# Altium project opo_v3.PrjPcb
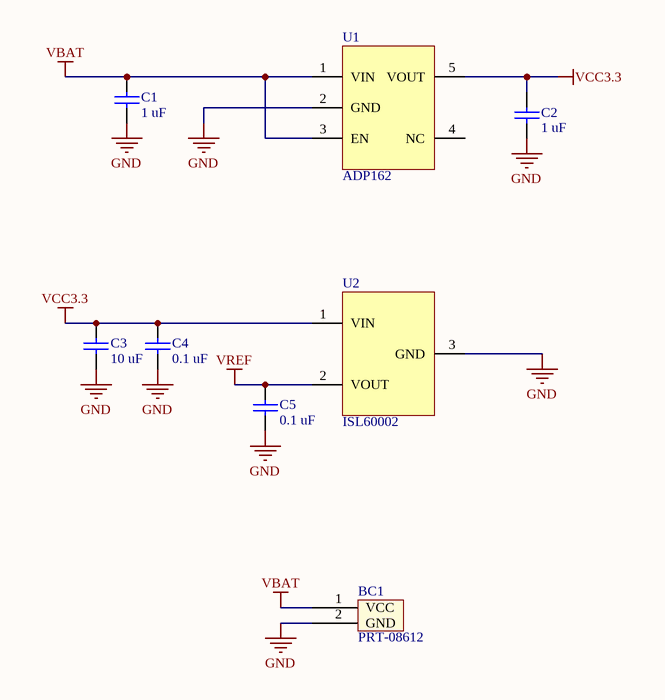
[diagram p0: power.SchDoc]
7 sheets, 103 parts. Net scope: flat (ports and power ports of the same name join across sheets).
Board file: opo_v3.0.PcbDoc
Sheets:
  power.SchDoc
  ultrasonic_rx.SchDoc
  ultrasonic_tx.SchDoc
  accero_humid_rtc.SchDoc
  mcu.SchDoc
  programming.SchDoc
  bluetooth.SchDoc

## Sheet power.SchDoc: Opo
size Letter; Author: William Huang; Engineer: William Huang; Revision: 3.0

### Parts
BC1  PRT-08612  [JST PH 2PIN]
C1  value 1 uF  [0402]  (hidden comment: Ceramic capacitor)
C2  value 1 uF  [0402]  (hidden comment: Ceramic capacitor)
C3  value 10 uF  [0402]  (hidden comment: Ceramic capacitor)
C4  value 0.1 uF  [0402]  (hidden comment: Ceramic capacitor)
C5  value 0.1 uF  [0402]  (hidden comment: Ceramic capacitor)
U1  ADP162  [TSOT23-5]
U2  ISL60002  [SOT23-3N]

### Nets
GND: BC1.2(GND) C1.2 C2.2 C3.2 C4.2 C5.2 U1.2(GND) U2.3(GND)
VBAT: BC1.1(VCC) C1.1 U1.1(VIN) U1.3(EN)
VCC3.3: C2.1 C3.1 C4.1 U1.5(VOUT) U2.1(VIN)
VREF: C5.1 U2.2(VOUT)

Not connected (* = marked no-connect by the designer): BC1 3 4; U1 4(NC)

### Notes on the sheet
- Title
- Date:
- Author:
- Revision:
- Sheet
- of
- University of Michigan
- File:

### Library data of the parts
BC1 = JST-PH-2mm-2Pin: 2-pin JST-PH 2mm Battery Connector; Supplier 1: Sparkfun; Supplier Part Number 1: PRT-08612
C1 C2 = C_1u_0402_ceramic: Ceramic capacitor, 1 uF, 0402 package; Manufacture: TDK; voltage rated: 6.3 V; tolerance: 10%; package: 0402; Supplier 1: Digi-Key; Supplier Part Number 1: 445-5000-1-ND
C3 = C_10u_0402_ceramic: Ceramic capacitor, 10 uF, 0402 package; Manufacture: TDK; voltage rated: 4V; tolerance: 20%; package: 0402; Supplier 1: Digi-Key; Supplier Part Number 1: 445-8919-1-ND
C4 C5 = C_0.1u_0402_ceramic: Ceramic capacitor, 0.1u, 0402 package; Manufacture: TDK; voltage rated: 10 V; tolerance: 10%; Supplier 1: Digi-Key; Supplier Part Number 1: 445-1265-1-ND; package: 0402
U1 = ADP162: IC REG LDO 3.3V 0.15A TSOT23-5; Supplier 1: Digi-Key; Supplier Part Number 1: ADP162AUJZ-3.3-R7CT-ND
U2 = ISL60002: IC VREF SERIES PREC SOT-23-3; Supplier 1: Digi-Key; Supplier Part Number 1: ISL60002DIH310Z-TKCT-ND

## Sheet ultrasonic_rx.SchDoc: Opo
size Letter; Author: William Huang; Engineer: William Huang; Revision: 3.0
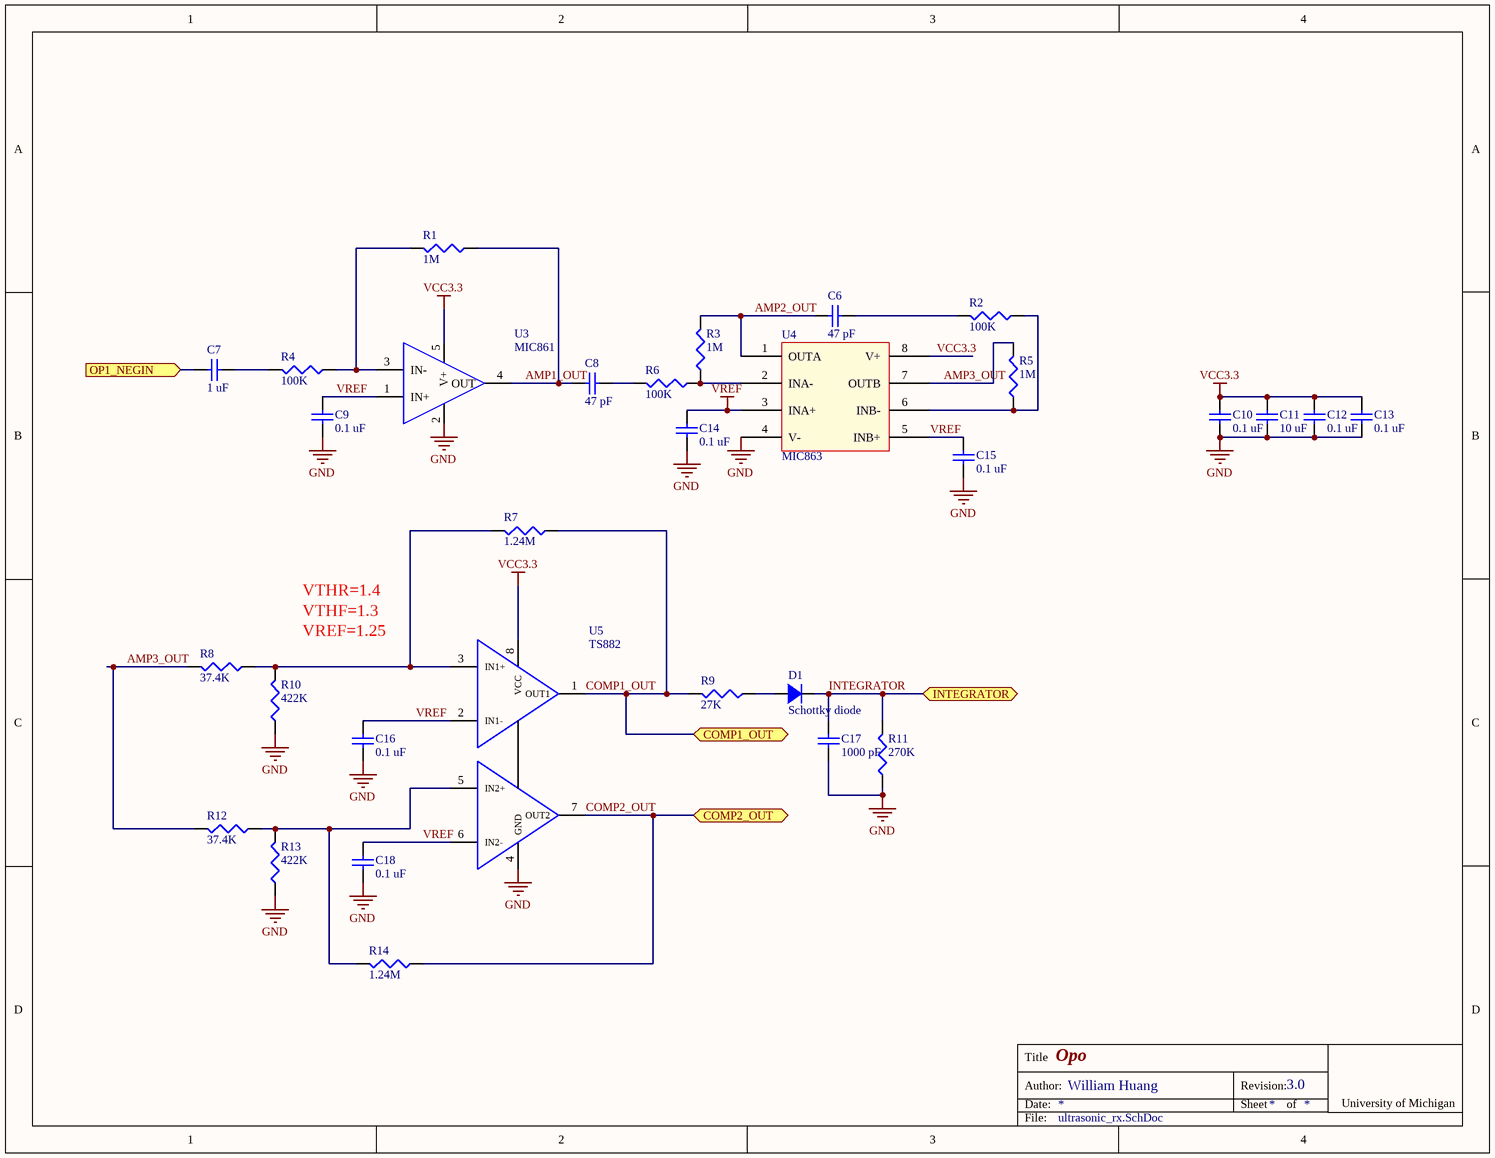
[diagram p1: ultrasonic_rx.SchDoc]

### Parts
C6  value 47 pF  [0402]  (hidden comment: Ceramic capacitor)
C7  value 1 uF  [0402]  (hidden comment: Ceramic capacitor)
C8  value 47 pF  [0402]  (hidden comment: Ceramic capacitor)
C9  value 0.1 uF  [0402]  (hidden comment: Ceramic capacitor)
C10  value 0.1 uF  [0402]  (hidden comment: Ceramic capacitor)
C11  value 10 uF  [0603]  (hidden comment: Ceramic capacitor)
C12  value 0.1 uF  [0402]  (hidden comment: Ceramic capacitor)
C13  value 0.1 uF  [0402]  (hidden comment: Ceramic capacitor)
C14  value 0.1 uF  [0402]  (hidden comment: Ceramic capacitor)
C15  value 0.1 uF  [0402]  (hidden comment: Ceramic capacitor)
C16  value 0.1 uF  [0402]  (hidden comment: Ceramic capacitor)
C17  value 1000 pF  [0402]  (hidden comment: Ceramic capacitor)
C18  value 0.1 uF  [0402]  (hidden comment: Ceramic capacitor)
D1  Schottky diode  [0603 - DIODE]
R1  value 1M  [0402]  (hidden comment: Chip resistor)
R2  value 100K  [0402]  (hidden comment: Chip resistor)
R3  value 1M  [0402]  (hidden comment: Chip resistor)
R4  value 100K  [0402]  (hidden comment: Chip resistor)
R5  value 1M  [0402]  (hidden comment: Chip resistor)
R6  value 100K  [0402]  (hidden comment: Chip resistor)
R7  value 1.24M  [0402]  (hidden comment: Chip resistor)
R8  value 37.4K  [0402]  (hidden comment: Chip resistor)
R9  value 27K  [0402]  (hidden comment: Chip resistor)
R10  value 422K  [0402]  (hidden comment: Chip resistor)
R11  value 270K  [0402]  (hidden comment: Chip resistor)
R12  value 37.4K  [0402]  (hidden comment: Chip resistor)
R13  value 422K  [0402]  (hidden comment: Chip resistor)
R14  value 1.24M  [0402]  (hidden comment: Chip resistor)
U3  MIC861  [SC70-5]
U4  MIC863  [TSOP65P280X145-8N]
U5  TS882  [SO8]

### Ports
COMP1_OUT, COMP2_OUT, INTEGRATOR, OP1_NEGIN (in)

### Nets
GND: C9.2 C10.2 C11.2 C12.2 C13.2 C14.2 C15.2 C16.2 C17.2 C18.2 R10.2 R11.2 R13.2 U3.2(V-) U4.4(V-) U5.4(GND)
VCC3.3: C10.1 C11.1 C12.1 C13.1 U3.5(V+) U4.8(V+) U5.8(VCC)
VREF: C9.1 C14.1 C15.1 C16.1 C18.1 U3.1(IN+) U4.3(INA+) U4.5(INB+) U5.2(IN1-) U5.6(IN2-)
AMP1_OUT: C8.1 R1.2 U3.4(OUT)
AMP2_OUT: C6.1 R3.1 U4.1(OUTA)
AMP3_OUT: R5.1 R8.1 R12.1 U4.7(OUTB)
COMP1_OUT: R7.2 R9.1 U5.1(OUT1) ; port COMP1_OUT
COMP2_OUT: R14.2 U5.7(OUT2) ; port COMP2_OUT
INTEGRATOR: C17.1 D1.2 R11.1 ; port INTEGRATOR
NetC6_2: C6.2 R2.1
NetC7_1: C7.1 ; port OP1_NEGIN
NetC7_2: C7.2 R4.1
NetC8_2: C8.2 R6.1
NetD1_1: D1.1 R9.2
NetR1_1: R1.1 R4.2 U3.3(IN-)
NetR2_2: R2.2 R5.2 U4.6(INB-)
NetR3_2: R3.2 R6.2 U4.2(INA-)
NetR7_1: R7.1 R8.2 R10.1 U5.3(IN1+)
NetR12_2: R12.2 R13.1 R14.1 U5.5(IN2+)

### Notes on the sheet
- VTHR=1.4
- VTHF=1.3
- VREF=1.25
- Title
- Date:
- Author:
- Revision:
- Sheet
- of
- University of Michigan
- File:

### Library data of the parts
C6 C8 = C_47p_0402_ceramic: Ceramic capacitor, 47 pF, 0402 package; Manufacture: Johanson; voltage rated: 50 V; tolerance: 5%; package: 0402; Supplier 1: Digi-Key; Supplier Part Number 1: 709-1121-1-ND
C7 = C_1u_0402_ceramic: as C1 on sheet power; package: 0402; Supplier 1: Digi-Key; Supplier Part Number 1: 445-5000-1-ND
C9 C10 C12-C16 C18 = C_0.1u_0402_ceramic: as C4 on sheet power; Supplier 1: Digi-Key; Supplier Part Number 1: 445-1265-1-ND; package: 0402
C11 = C_10u_0603_ceramic: Ceramic capacitor, 10 uF, 0603 package; Manufacture: TDK; voltage rated: 6.3V; tolerance: 20%; package: 0603; Supplier 1: Digi-Key; Supplier Part Number 1: 445-4112-1-ND
C17 = C_1000p_0402_ceramic: Ceramic capacitor, 1000 pF, 0402 package; Manufacture: TDK; voltage rated: 50 V; tolerance: 10%; package: 0402; Supplier 1: Digi-Key; Supplier Part Number 1: 445-6846-1-ND
D1 = D_SCHOTTKY_30V_0.1A_0603: Schottky diode 30 V 0.1 A 0603; package: 0603; Supplier 1: Digi-Key; Supplier Part Number 1: 641-1282-1-ND
R1 R3 R5 = R_1M_0402: Chip resistor, 1M, 0402 package; tolerance: 1%; power: 1/16 W; Supplier 1: Digi-Key; package: 0402; Supplier Part Number 1: 541-1.00MLCT-ND
R2 R4 R6 = R_100K_0402: Chip resistor, 100K, 0402 package; tolerance: 1%; power: 1/16 W; Supplier 1: Digi-Key; Supplier Part Number 1: 541-100KLCT-ND; package: 0402
R7 R14 = R_1.24M_0402: Chip resistor, 1.24M, 0402 package; tolerance: 1%; power: 1/16 W; package: 0402; Supplier 1: Digi-Key; Supplier Part Number 1: 541-1.24MLCT-ND
R8 R12 = R_37.4K_0402: Chip resistor, 37.4K, 0402 package; tolerance: 1%; power: 1/16 W; package: 0402; Supplier 1: Digi-Key; Supplier Part Number 1: 541-37.4KLCT-ND
R9 = R_27K_0402: Chip resistor, 27K, 0402 package; tolerance: 1%; power: 1/16 W; package: 0402; Supplier 1: Digi-Key; Supplier Part Number 1: 541-27.0KLCT-ND
R10 R13 = R_422K_0402: Chip resistor, 422K, 0402 package; tolerance: 1%; power: 1/16 W; package: 0402; Supplier 1: Digi-Key; Supplier Part Number 1: 541-422KLCT-ND
R11 = R_270K_0402: Chip resistor, 270K, 0402 package; tolerance: 1%; power: 1/16 W; package: 0402; Supplier 1: Digi-Key; Supplier Part Number 1: 541-270KLCT-ND
U3 = MIC861: IC OPAMP 400KHZ 2.7V ULT LP SC70; Supplier 1: Digi-Key; Supplier Part Number 1: 576-2932-1-ND
U4 = MIC863: Dual Ultra Low Power Op Amp in SOT23-8; Supplier 1: Digi-Key; Supplier Part Number 1: 576-2934-1-ND
U5 = TS882: Ultra Low Power Dual Comparator; Supplier 1: Digikey; Supplier 2: Digikey; Supplier 2 Part Number: 497-13800-1-ND; Supplier Part Number 1: 497-14073-1-ND

## Sheet ultrasonic_tx.SchDoc: Opo
size Letter; Author: William Huang; Engineer: William Huang; Revision: 3.0
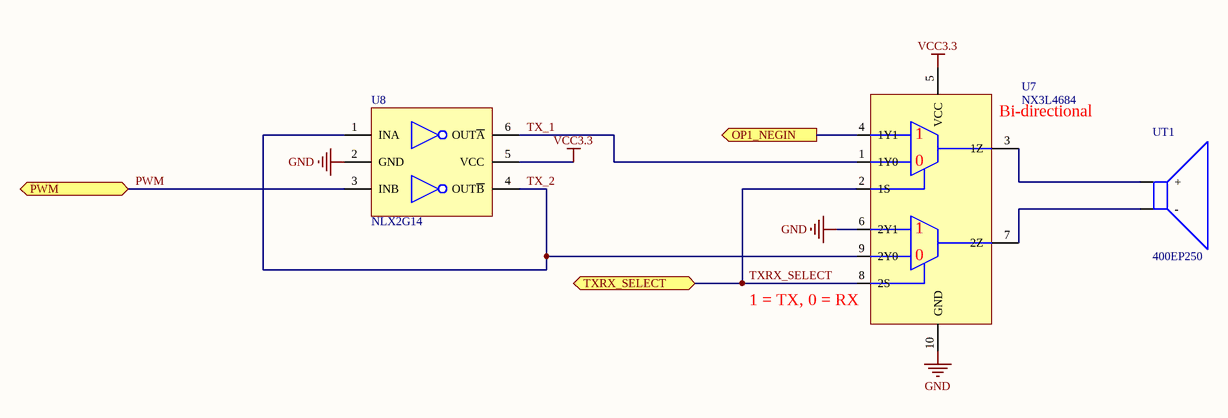
[diagram p2: ultrasonic_tx.SchDoc]

### Parts
U7  NX3L4684  [QFN50P155X200X13-10N]
U8  NLX2G14  [ULLGA6]
UT1  400EP250  [Transducer recepticle]

### Ports
OP1_NEGIN (out), PWM, TXRX_SELECT

### Nets
GND: U7.6(2Y1) U7.10(GND) U8.2(GND)
VCC3.3: U7.5(VCC) U8.5(VCC)
PWM: U8.3(INB) ; port PWM
TX_1: U7.1(1Y0) U8.6(OUT~{A})
TX_2: U7.9(2Y0) U8.1(INA) U8.4(OUT~{B})
TXRX_SELECT: U7.2(1S) U7.8(2S) ; port TXRX_SELECT
NetC7_1: U7.4(1Y1) ; port OP1_NEGIN
NetU7_3: U7.3(1Z) UT1.2(+)
NetU7_7: U7.7(2Z) UT1.1(-)

### Notes on the sheet
- (near U7) Bi-directional
- (near U7) 1 = TX, 0 = RX
- Title
- Date:
- Author:
- Revision:
- Sheet
- of
- University of Michigan
- File:
- (in symbol NX3L4684) 0

### Library data of the parts
U7 = NX3L4684: IC ANALOG SWITCH SPDT 10XQFN; Supplier 1: Digi-Key; Supplier Part Number 1: 568-5564-1-ND
U8 = NLX2G14: IC INVERTER DUAL SCHMTRIG ULLGA6; Supplier 1: Digi-Key; Supplier Part Number 1: NLX2G14AMX1TCGOSCT-ND
UT1 = Tranducer: Air Ultrasounic Ceramic Transducers; Supplier 1: Digi-Key; Supplier Part Number 1: ED90088-ND

## Sheet accero_humid_rtc.SchDoc: Opo
size Letter; Author: William Huang; Engineer: William Huang; Revision: 3.0
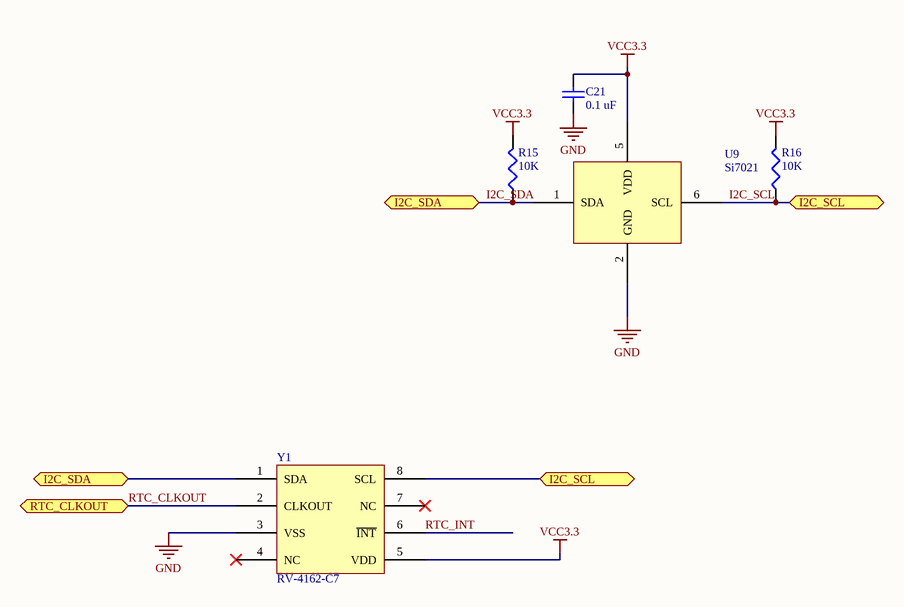
[diagram p3: accero_humid_rtc.SchDoc]

### Parts
C21  value 0.1 uF  [0402]  (hidden comment: Ceramic capacitor)
R15  value 10K  [0402]  (hidden comment: Chip resistor)
R16  value 10K  [0402]  (hidden comment: Chip resistor)
U9  Si7021  [DFN6-Si7021]
Y1  RV-4162-C7  [RV4162]

### Ports
I2C_SCL, I2C_SDA, RTC_CLKOUT

### Nets
GND: C21.2 U9.2(GND) Y1.3(VSS)
VCC3.3: C21.1 R15.1 R16.1 U9.5(VDD) Y1.5(VDD)
I2C_SCL: R16.2 U9.6(SCL) Y1.8(SCL) ; port I2C_SCL
I2C_SDA: R15.2 U9.1(SDA) Y1.1(SDA) ; port I2C_SDA
RTC_CLKOUT: Y1.2(CLKOUT) ; port RTC_CLKOUT
RTC_INT: Y1.6(~{INT})

Not connected (* = marked no-connect by the designer): U9 3(DNC) 4(DNC) 7(DNC); Y1 4(NC)* 7(NC)*

### Notes on the sheet
- Title
- Date:
- Author:
- Revision:
- Sheet
- of
- University of Michigan
- File:

### Library data of the parts
C21 = C_0.1u_0402_ceramic: as C4 on sheet power; Supplier 1: Digi-Key; Supplier Part Number 1: 445-1265-1-ND; package: 0402
R15 R16 = R_10K_0402: Chip resistor, 10K, 0402 package; tolerance: 1%; power: 1/16 W; Supplier 1: Digi-Key; Supplier Part Number 1: 541-10.0KLDKR-ND; package: 0402
U9 = Si7021: Temperature and Humidity Sensor; Supplier 1: Digikey; Supplier Part Number 1: 336-2542-1-ND
Y1 = RV-4162-C7: Real Time Clock Module with I2C Bus; Supplier 1: Newark; Supplier Part Number 1: 09X0517

## Sheet mcu.SchDoc: Opo
size Letter; Author: William Huang; Engineer: William Huang; Organization: Altium Limited; Address1: L3, 12a Rodborough Rd; Address2: Frenchs Forest; Address3: NSW; Address4: Australia 2086; Revision: 3.0; PageSetup: Record=PageOptions|CenterHorizontal=True|CenterVertical=True|PrintScale=0.94|XCorrection=1.00|YCorrection=1.00|PrintKind=0|BorderSize=5000000|LeftOffset=0|BottomOffset=0|Orientation=2|PaperLength=1000|PaperWidth=1000|Scale=100|PaperSource=7|PrintQuality=-4|MediaType=1|DitherType=10|PaperKind=Letter|PrintScaleMode=1
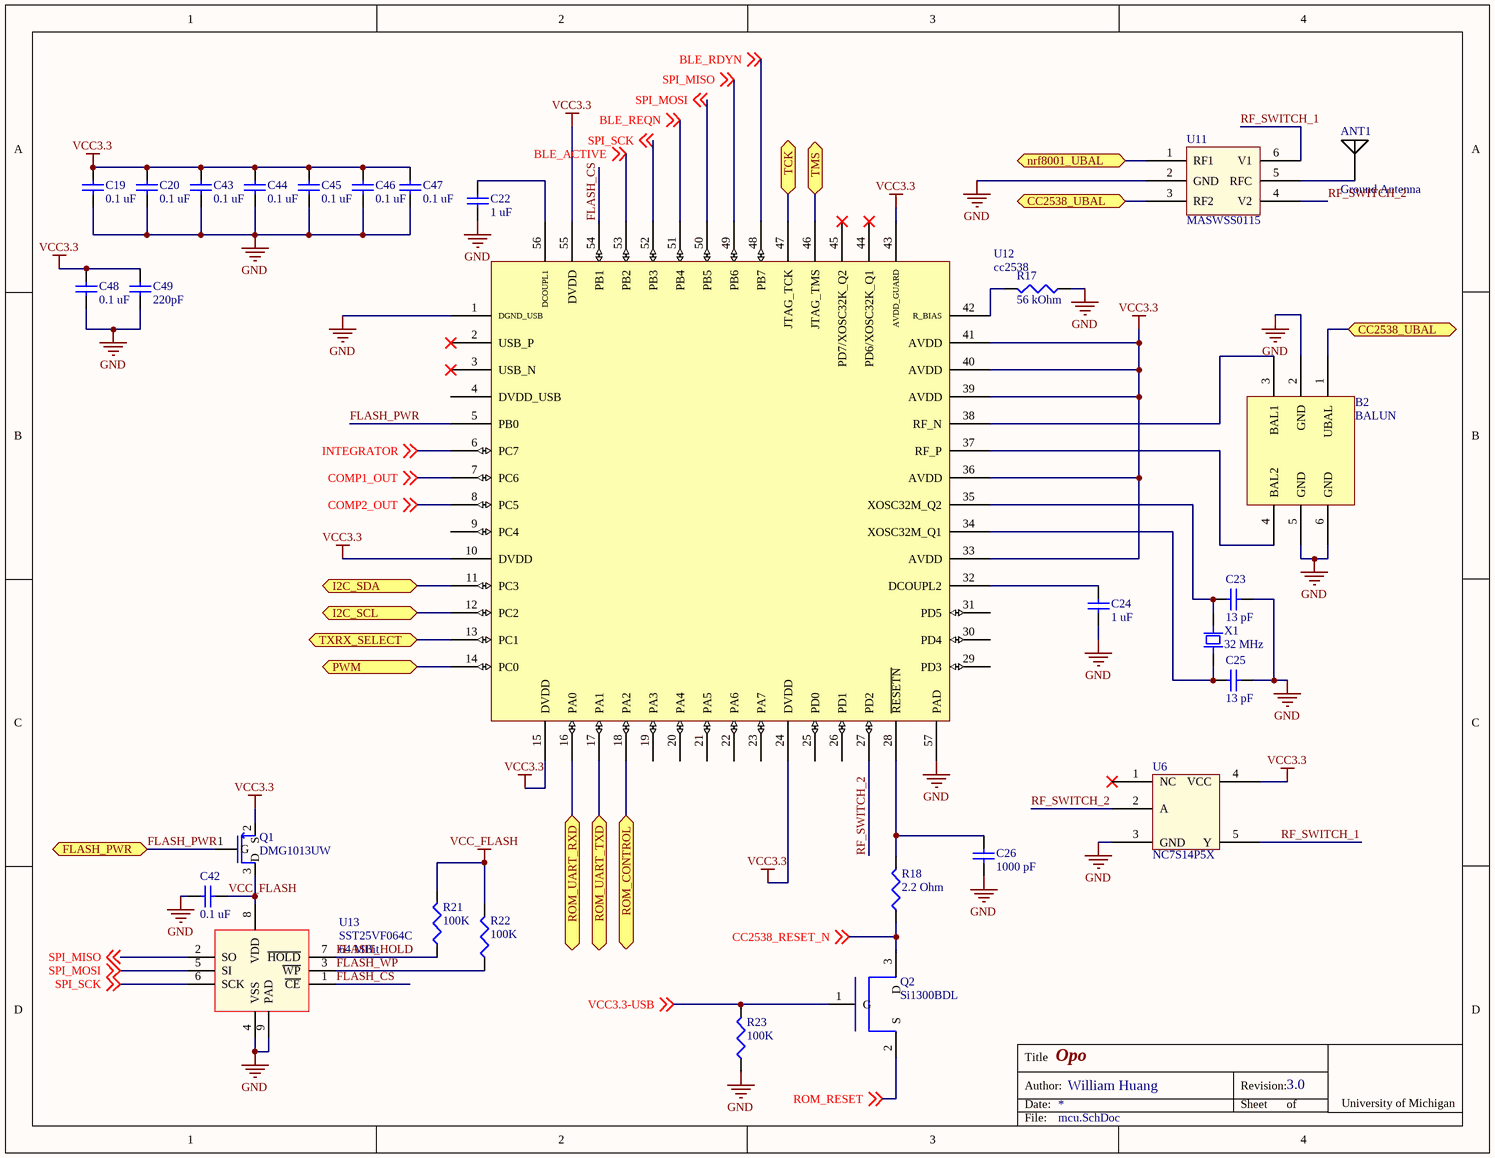
[diagram p4: mcu.SchDoc]

### Parts
ANT1  Ground Antenna  [Chip Antenna]
B2  BALUN  [Chip Balun]
C19  value 0.1 uF  [0402]  (hidden comment: Ceramic capacitor)
C20  value 0.1 uF  [0402]  (hidden comment: Ceramic capacitor)
C22  value 1 uF  [0402]  (hidden comment: Ceramic capacitor)
C23  value 13 pF  [0402]  (hidden comment: 13pf 0402 Cap)
C24  value 1 uF  [0402]  (hidden comment: Ceramic capacitor)
C25  value 13 pF  [0402]  (hidden comment: 13pf 0402 Cap)
C26  value 1000 pF  [0402]  (hidden comment: Ceramic capacitor)
C42  value 0.1 uF  [0402]  (hidden comment: Ceramic capacitor)
C43  value 0.1 uF  [0402]  (hidden comment: Ceramic capacitor)
C44  value 0.1 uF  [0402]  (hidden comment: Ceramic capacitor)
C45  value 0.1 uF  [0402]  (hidden comment: Ceramic capacitor)
C46  value 0.1 uF  [0402]  (hidden comment: Ceramic capacitor)
C47  value 0.1 uF  [0402]  (hidden comment: Ceramic capacitor)
C48  value 0.1 uF  [0402]  (hidden comment: Ceramic capacitor)
C49  value 220pF  [0402]  (hidden comment: 220pF 0402 ceramic cap)
Q1  DMG1013UW  [SC70-3]
Q2  Si1300BDL  [SC70-3]
R17  value 56 kOhm  [0402]  (hidden comment: 56k 0402 Res)
R18  value 2.2 Ohm  [0402]  (hidden comment: 2.2 Ohm 0402 Res)
R21  value 100K  [0402]  (hidden comment: Chip resistor)
R22  value 100K  [0402]  (hidden comment: Chip resistor)
R23  value 100K  [0402]  (hidden comment: Chip resistor)
U6  NC7S14P5X  [SC70-5]
U11  MASWSS0115  [SC70-6]
U12  cc2538  [QFN50P800X800X100_HS-57N]
U13  SST25VF064C  Capacity: 64 MBit  [WSON]
X1  value 32 MHz  [FA-128]  (hidden comment: 32 MHz Crystal)

### Ports
CC2538_UBAL, FLASH_PWR, I2C_SCL, I2C_SDA, nrf8001_UBAL, PWM, ROM_CONTROL, ROM_UART_RXD, ROM_UART_TXD, TCK, TMS, TXRX_SELECT

### Nets
GND: B2.2(GND) B2.5(GND) B2.6(GND) C19.2 C20.2 C22.2 C23.2 C24.2 C25.1 C26.2 C42.1 C43.2 C44.2 C45.2 C46.2 C47.2 C48.2 C49.2 R17.2 R23.2 U6.3(GND) U11.2(GND) U12.1(DGND_USB) U12.57(PAD) U13.4(VSS) U13.9(PAD)
VCC3.3: C19.1 C20.1 C43.1 C44.1 C45.1 C46.1 C47.1 C48.1 C49.1 Q1.2(S) U6.4(VCC) U12.10(DVDD) U12.15(DVDD) U12.24(DVDD) U12.33(AVDD) U12.36(AVDD) U12.39(AVDD) U12.40(AVDD) U12.41(AVDD) U12.43(AVDD_GUARD) U12.55(DVDD)
VCC_FLASH: C42.2 Q1.3(D) R21.1 R22.1 U13.8(VDD)
BLE_ACTIVE: U12.53(PB2) ; off-sheet BLE_ACTIVE
BLE_RDYN: U12.48(PB7) ; off-sheet BLE_RDYN
BLE_REQN: U12.51(PB4) ; off-sheet BLE_REQN
CC2538_RESET_N: Q2.3(D) R18.2 ; off-sheet CC2538_RESET_N
COMP1_OUT: U12.7(PC6) ; off-sheet COMP1_OUT
COMP2_OUT: U12.8(PC5) ; off-sheet COMP2_OUT
FLASH_CS: U12.54(PB1) U13.1(~{CE})
FLASH_HOLD: R21.2 U13.7(~{HOLD})
FLASH_PWR: Q1.1(G) U12.5(PB0) ; port FLASH_PWR
FLASH_WP: R22.2 U13.3(~{WP})
I2C_SCL: U12.12(PC2) ; port I2C_SCL
I2C_SDA: U12.11(PC3) ; port I2C_SDA
INTEGRATOR: U12.6(PC7) ; off-sheet INTEGRATOR
PWM: U12.14(PC0) ; port PWM
RF_SWITCH_1: U6.5(Y) U11.6(V1)
RF_SWITCH_2: U6.2(A) U11.4(V2) U12.27(PD2)
ROM_CONTROL: U12.18(PA2) ; port ROM_CONTROL
ROM_RESET: Q2.2(S) ; off-sheet ROM_RESET
ROM_UART_RXD: U12.16(PA0) ; port ROM_UART_RXD
ROM_UART_TXD: U12.17(PA1) ; port ROM_UART_TXD
SPI_MISO: U12.49(PB6) U13.2(SO) ; off-sheet SPI_MISO
SPI_MOSI: U12.50(PB5) U13.5(SI) ; off-sheet SPI_MOSI
SPI_SCK: U12.52(PB3) U13.6(SCK) ; off-sheet SPI_SCK
TXRX_SELECT: U12.13(PC1) ; port TXRX_SELECT
VCC3.3-USB: Q2.1(G) R23.1 ; off-sheet VCC3.3-USB
NetANT1_1: ANT1.1 U11.5(RFC)
NetB1_1: U11.1(RF1) ; port nrf8001_UBAL
NetB2_1: B2.1(UBAL) U11.3(RF2) ; port CC2538_UBAL
NetB2_3: B2.3(BAL1) U12.38(RF_N)
NetB2_4: B2.4(BAL2) U12.37(RF_P)
NetC22_1: C22.1 U12.56(DCOUPL1)
NetC23_1: C23.1 U12.35(XOSC32M_Q2) X1.1
NetC24_1: C24.1 U12.32(DCOUPL2)
NetC25_2: C25.2 U12.34(XOSC32M_Q1) X1.3
NetC26_1: C26.1 R18.1 U12.28(~{RESETN})
NetR17_1: R17.1 U12.42(R_BIAS)
NetU12_46: U12.46(JTAG_TMS) ; port TMS
NetU12_47: U12.47(JTAG_TCK) ; port TCK

Not connected (* = marked no-connect by the designer): U6 1(NC)*; U12 2(USB_P)* 3(USB_N)* 4(DVDD_USB) 9(PC4) 19(PA3) 20(PA4) 21(PA5) 22(PA6) 23(PA7) 25(PD0) 26(PD1) 29(PD3) 30(PD4) 31(PD5) 44(PD6/XOSC32K_Q1)* 45(PD7/XOSC32K_Q2)*

### Notes on the sheet
- Title
- Date:
- Author:
- Revision:
- Sheet
- of
- University of Michigan
- File:

### Library data of the parts
ANT1 = Ground Antenna: 2.4GHz Surface Mount Device (SMD) On Ground Antenna, 50 Ohms; Supplier 1: RichardsonRFPD; Supplier Part Number 1: FR05-S1-N-0102B
B2 = cc2538_Balun: Johanson CC253X Balun; Supplier 1: Digikey; Supplier Part Number 1: 712-1536-1-ND
C19 C20 C42-C48 = C_0.1u_0402_ceramic: as C4 on sheet power; Supplier 1: Digi-Key; Supplier Part Number 1: 445-1265-1-ND; package: 0402
C22 C24 = C_1u_0402_ceramic: as C1 on sheet power; package: 0402; Supplier 1: Digi-Key; Supplier Part Number 1: 445-5000-1-ND
C23 C25 = C_13p_0402: 13pf, 50V, 2%, c0G, NP0, 0402, ceramic; Mfr: Murata; Mfr Part Number: GRM1555C1H130GA01D; Supplier 1: Digikey; Supplier Part Number 1: 490-8184-1-ND
C26 = C_1000p_0402_ceramic: as C17 on sheet ultrasonic_rx; package: 0402; Supplier 1: Digi-Key; Supplier Part Number 1: 445-6846-1-ND
C49 = C_220pf_0402_ceramic: 220pF 5% 50 V C0G NP0 0402 ceramic cap; Mfr: Murata; Mfr Part Number: GRM1555C1H221JA01D; Supplier 1: Digikey; Supplier Part Number 1: 490-1293-1-ND
Q1 = DMG1013UW: P-CHANNEL ENHANCEMENT MODE MOSFET; Supplier 1: Digi-Key; Supplier Part Number 1: DMG1013UW-7DICT-ND
Q2 = Si1300BDL: MOSFET N-CH D-S 20V SC-70-3; Supplier 1: Digi-Key; Supplier Part Number 1: SI1300BDL-T1-GE3CT-ND
R17 = R_56K_0402: 56 kOhm, 1%, .0603 W, 0402; Mfr: Rohm; Mfr Part Number: MCR01MRTF5602; Supplier 1: Digikey; Supplier Part Number 1: RHM56.0KCDCT-ND
R18 = R_2.2_0402: 2.2 Ohm, 1%, .063W, 0402; Mfr: Vishay Dale; Mfr Part Number: CRCW04022R20FKED; Supplier 1: Digikey; Supplier Part Number 1: 541-2.20LLCT-ND
R21-R23 = R_100K_0402: as R2 on sheet ultrasonic_rx; Supplier 1: Digi-Key; Supplier Part Number 1: 541-100KLCT-ND; package: 0402
U6 = NC7S14P5X: Single Inverter; Mfr: Fairchild; Mfr Part Number: NC7S14P5X; Supplier 1: Digikey; Supplier Part Number 1: NC7S14P5XDKR-ND
U11 = MASWSS0115: Rf Switch; Mfr: M/A-Com; Mfr Part Number: MASWSS0115TR-3000; Supplier 1: Digikey; Supplier Part Number 1: 1465-1373-1-ND
U12 = cc2538: cc2538 MCU/802.15.4 radio; Supplier 1: Digikey; Supplier Part Number 1: 296-35797-1-ND
U13 = SST25VF064C: 64 Mbit SPI Serial Dual I/O Flash; Supplier 1: Digi-Key; Supplier Part Number 1: SST25VF064C-80-4I-Q2AE-CT-ND
X1 = X_32M_FA-128: 32MHz, 10ppm, 10pF, 60 Ohm; Mfr: Epson; Mfr Part Number: FA-128 32.0000MF20X-K3; Supplier 1: Digikey; Supplier Part Number 1: SER3800CT-ND

## Sheet programming.SchDoc: Opo
size Letter; Author: William Huang; Engineer: William Huang; Revision: 3.0
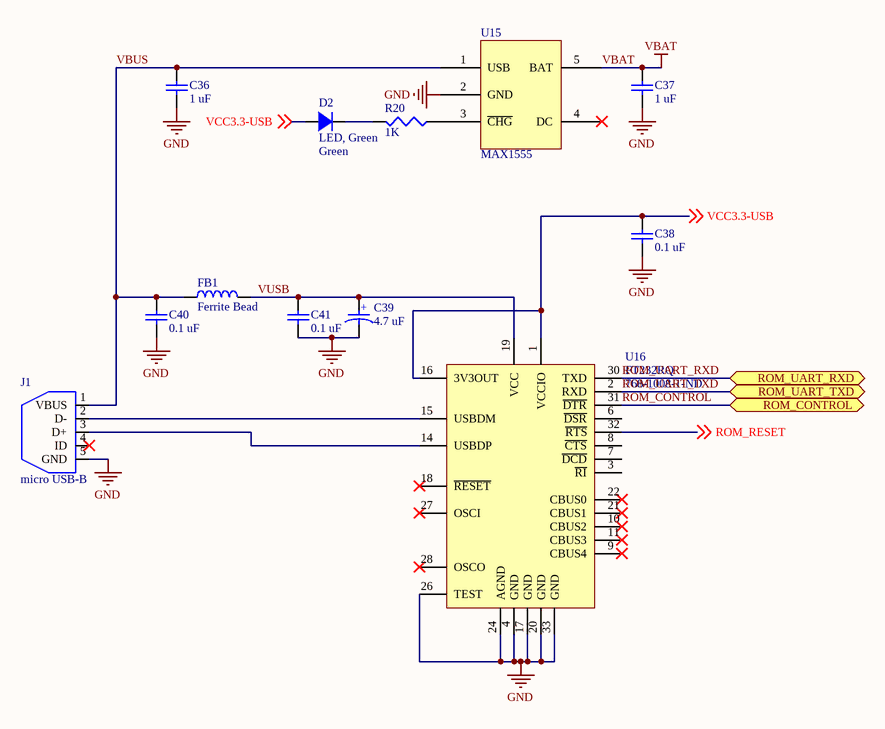
[diagram p5: programming.SchDoc]

### Parts
C36  value 1 uF  [0402]  (hidden comment: Ceramic capacitor)
C37  value 1 uF  [0402]  (hidden comment: Ceramic capacitor)
C38  value 0.1 uF  [0402]  (hidden comment: Ceramic capacitor)
C39  value 4.7 uF  [0603 - Polar Marking]  (hidden comment: Tantalum capacitor)
C40  value 0.1 uF  [0402]  (hidden comment: Ceramic capacitor)
C41  value 0.1 uF  [0402]  (hidden comment: Ceramic capacitor)
D2  LED, Green  Color: Green  [0402 - DIODE]
FB1  Ferrite Bead  [0402]
J1  micro USB-B  [Micro USB-B]
R20  value 1K  [0402]  (hidden comment: Chip resistor)
U15  MAX1555  [SOT23-5]
U16  FT232RQ  Supplier Part Number 1: 768-1008-1-ND  [QFN-32]

### Ports
ROM_CONTROL, ROM_UART_RXD, ROM_UART_TXD

### Nets
GND: C36.2 C37.2 C38.2 C39.2 C40.2 C41.2 J1.5(GND) U15.2(GND) U16.4(GND) U16.17(GND) U16.20(GND) U16.24(AGND) U16.26(TEST) U16.33(GND)
VBAT: C37.1 U15.5(BAT)
ROM_CONTROL: U16.31(~{DTR}) ; port ROM_CONTROL
ROM_RESET: U16.32(~{RTS}) ; off-sheet ROM_RESET
ROM_UART_RXD: U16.30(TXD) ; port ROM_UART_RXD
ROM_UART_TXD: U16.2(RXD) ; port ROM_UART_TXD
VBUS: C36.1 C40.1 FB1.2 J1.1(VBUS) U15.1(USB)
VCC3.3-USB: C38.1 D2.1 U16.1(VCCIO) U16.16(3V3OUT) ; off-sheet VCC3.3-USB
VUSB: C39.1 C41.1 FB1.1 U16.19(VCC)
NetD2_2: D2.2 R20.1
NetJ1_2: J1.2(D-) U16.15(USBDM)
NetJ1_3: J1.3(D+) U16.14(USBDP)
NetR20_2: R20.2 U15.3(~{CHG})

Not connected (* = marked no-connect by the designer): J1 4(ID)*; U15 4(DC)*; U16 3(~{RI}) 6(~{DSR}) 7(~{DCD}) 8(~{CTS}) 9(CBUS4)* 10(CBUS2)* 11(CBUS3)* 18(~{RESET})* 21(CBUS1)* 22(CBUS0)* 27(OSCI)* 28(OSCO)*

### Notes on the sheet
- Title
- Date:
- Author:
- Revision:
- Sheet
- of
- University of Michigan
- File:
- (in symbol C_4.7u_0603_tantalum) +

### Library data of the parts
C36 C37 = C_1u_0402_ceramic: as C1 on sheet power; package: 0402; Supplier 1: Digi-Key; Supplier Part Number 1: 445-5000-1-ND
C38 C40 C41 = C_0.1u_0402_ceramic: as C4 on sheet power; Supplier 1: Digi-Key; Supplier Part Number 1: 445-1265-1-ND; package: 0402
C39 = C_4.7u_0603_tantalum: Tantalum capacitor, 4.7 uF, 0603 package; Manufacture: Rohm; voltage rated: 10 V; tolerance: 20%; package: 0603; Supplier 1: Digi-Key; Supplier Part Number 1: 511-1496-1-ND
D2 = D_LED_GREEN_0402: LED, Green,  0402; package: 0402; Supplier 1: Digi-Key; Supplier Part Number 1: 511-1592-1-ND
FB1 = FB_150mA_0402: Ferrite Bead, 150 mA, 0402 package; impedance@Freq: 1K@100 MHz; current rating: 150 mA; Supplier 1: Digi-Key; Supplier Part Number 1: 587-1835-1-ND; package: 0402
J1 = Micro USB: CONN USB MICRO B RECPT SMT R/A; Supplier 1: Digi-Key; Supplier Part Number 1: 609-4616-6-ND
R20 = R_1K_0402: Chip resistor, 1K, 0402 package; tolerance: 1%; power: 1/16 W; Supplier 1: Digi-Key; Supplier Part Number 1: 541-1.00KLCT-ND; package: 0402
U15 = MAX1555: 3 Dual-Input USB/AC Adapter 1-Cell Li+  Battery Chargers; Supplier 1: Digi-Key; Supplier Part Number 1: MAX1555EZK+TTR-ND
U16 = IC_FT232RQ: FT232R USB UART; Manufacturer: *; Note: *; ManufacturerPartNo: *; Supplier 1: Digi-Key

## Sheet bluetooth.SchDoc
size Letter
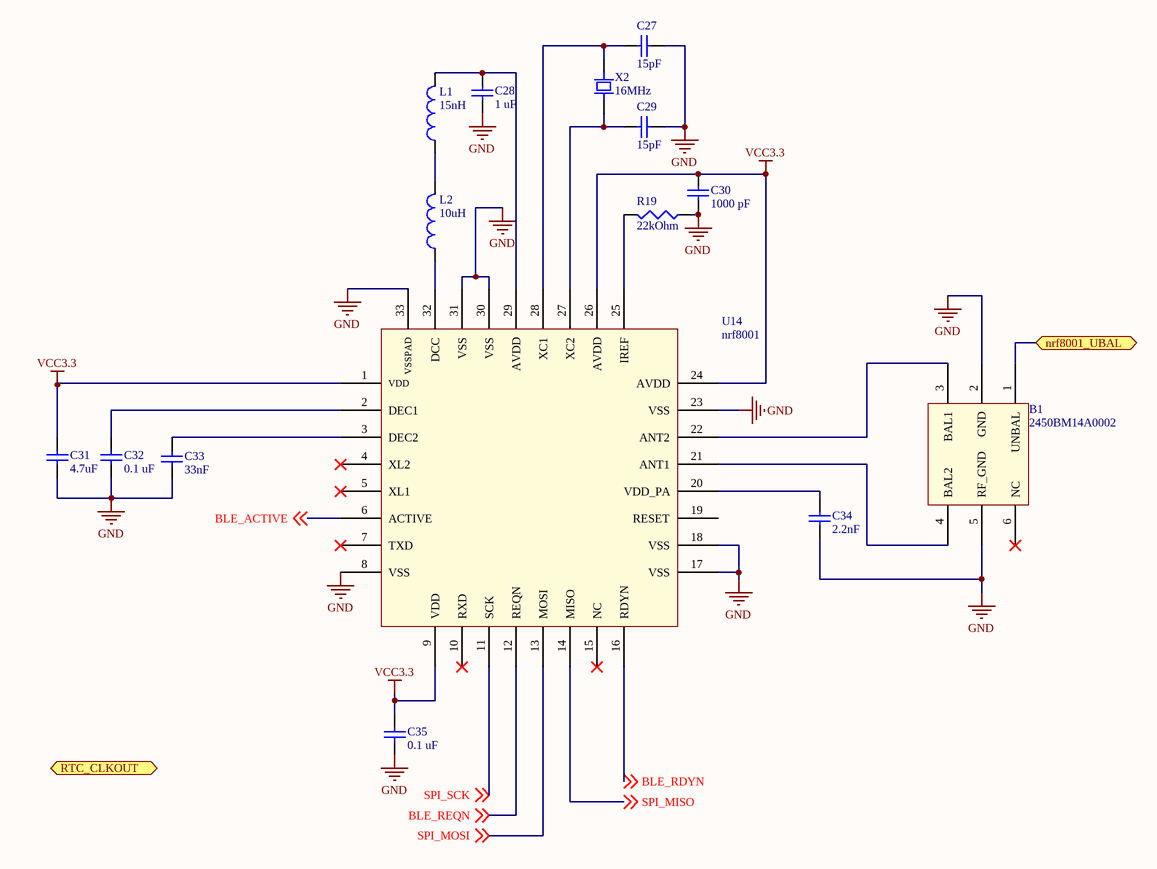
[diagram p6: bluetooth.SchDoc]

### Parts
B1  2450BM14A0002  [2450BM14A0002]
C27  value 15pF  [0402]  (hidden comment: 15pF 0402 ceramic cap)
C28  value 1 uF  [0402]  (hidden comment: Ceramic capacitor)
C29  value 15pF  [0402]  (hidden comment: 15pF 0402 ceramic cap)
C30  value 1000 pF  [0402]  (hidden comment: Ceramic capacitor)
C31  4.7uF  [0402]
C32  value 0.1 uF  [0402]  (hidden comment: Ceramic capacitor)
C33  33nF  [0402]
C34  2.2nF  [0402]
C35  value 0.1 uF  [0402]  (hidden comment: Ceramic capacitor)
L1  value 15nH  [0402]  (hidden comment: 15nH chip inductor)
L2  value 10uH  [0603]  (hidden comment: 10uH chip inductor)
R19  value 22kOhm  [0402]  (hidden comment: 22k 0402 resistor)
U14  nrf8001  [QFN50P500X500X90_HS-33N]
X2  value 16MHz  [TSX-3225]  (hidden comment: 16MHz Crystal)

### Ports
nrf8001_UBAL, RTC_CLKOUT

### Nets
GND: B1.2(GND) B1.5(RF_GND) C27.2 C28.2 C29.1 C30.2 C31.2 C32.2 C33.2 C34.2 C35.2 R19.2 U14.8(VSS) U14.17(VSS) U14.18(VSS) U14.23(VSS) U14.30(VSS) U14.31(VSS) U14.33(VSSPAD) X2.2 X2.4
VCC3.3: C30.1 C31.1 C35.1 U14.1(VDD) U14.9(VDD) U14.24(AVDD) U14.26(AVDD)
BLE_ACTIVE: U14.6(ACTIVE) ; off-sheet BLE_ACTIVE
BLE_RDYN: U14.16(RDYN) ; off-sheet BLE_RDYN
BLE_REQN: U14.12(REQN) ; off-sheet BLE_REQN
SPI_MISO: U14.14(MISO) ; off-sheet SPI_MISO
SPI_MOSI: U14.13(MOSI) ; off-sheet SPI_MOSI
SPI_SCK: U14.11(SCK) ; off-sheet SPI_SCK
NetB1_1: B1.1(UNBAL) ; port nrf8001_UBAL
NetB1_3: B1.3(BAL1) U14.22(ANT2)
NetB1_4: B1.4(BAL2) U14.21(ANT1)
NetC27_1: C27.1 U14.28(XC1) X2.1
NetC28_1: C28.1 L1.1 U14.29(AVDD)
NetC29_2: C29.2 U14.27(XC2) X2.3
NetC32_1: C32.1 U14.2(DEC1)
NetC33_1: C33.1 U14.3(DEC2)
NetC34_1: C34.1 U14.20(VDD_PA)
NetL1_2: L1.2 L2.1
NetL2_2: L2.2 U14.32(DCC)
NetR19_1: R19.1 U14.25(IREF)

Not connected (* = marked no-connect by the designer): B1 6(NC)*; U14 4(XL2)* 5(XL1)* 7(TXD)* 10(RXD)* 15(NC)* 19(RESET)

### Notes on the sheet
- Title
- Date:
- Author:
- Revision:
- Sheet
- of
- University of Michigan
- File:

### Library data of the parts
B1 = nrf8001_balun: nrf8001 chip balun; Mfr: Johanson; Mfr Part Number: 2450BM14A0002; Supplier 1: Digikey; Supplier Part Number 1: 712-1574-1-ND
C27 C29 = C_15p_0402_ceramic: 15pF, 2%, NP0, 0402; Mfr: Murata; Mfr Part Number: GRM1555C1H150GA01D; Supplier 1: Digikey; Supplier Part Number 1: 490-6201-1-ND
C28 = C_1u_0402_ceramic: as C1 on sheet power; package: 0402; Supplier 1: Digi-Key; Supplier Part Number 1: 445-5000-1-ND
C30 = C_1000p_0402_ceramic: as C17 on sheet ultrasonic_rx; package: 0402; Supplier 1: Digi-Key; Supplier Part Number 1: 445-6846-1-ND
C31 = C_4.7u_0402_ceramic: 4.7 uF 10% 0402 6.3V X5R ceramic cap; Manufacturer: TDK; Supplier 1: Digikey; Supplier Part Number 1: 445-5947-1-ND
C32 C35 = C_0.1u_0402_ceramic: as C4 on sheet power; Supplier 1: Digi-Key; Supplier Part Number 1: 445-1265-1-ND; package: 0402
C33 = C_0.033uF_0402_ceramic: 33nF 10% 0402 16V X7R ceramic cap; Manufacturer: Samsung; Supplier 1: Digikey; Supplier Part Number 1: 1276-1177-1-ND
C34 = C_2.2n_0402_ceramic: 2.2nF 10% 50V X7R ceramic cap; Manufacturer: TDK; Supplier 1: Digikey; Supplier Part Number 1: 445-1257-1-ND
L1 = L_15nH_0402: 15 nH, 5%, 460mOhm, 2.3Ghz, 0402 chip inductor; Mfr: Taiyo Yuden; Mfr Part Number: HK100515NJ-T; Supplier 1: Digikey; Supplier Part Number 1: 587-1521-1-ND
L2 = L_10u_0603: 10uH, 10%, 32MHz, 468 mOhm, 0603, chip inductor; Mfr: Taiyo Yuden; Mfr Part Number: LBMF1608T100K; Supplier 1: Digikey; Supplier Part Number 1: LBMF1608T100K
R19 = R_22k_0402: 22k 1% .063W 0402 resistor; Mfr: Samsung; Mfr Part Number: RC1005F223CS; Supplier 1: Digikey; Supplier Part Number 1: 1276-4143-1-ND
U14 = nrf8001: nrf8001 Bluetooth SPI module; Supplier 1: Digikey; Supplier Part Number 1: 1490-1026-ND
X2 = TSX-3225: 3.2x2.5mm 16MHz SMD crystal; Mfr: Epson; Mfr part Number: TSX-3225 16.0000MF09Z-AC3; Supplier 1: Digikey; Supplier Part Number 1: SER3628CT-ND

## Nets that join several sheets
GND: power (8 pins), ultrasonic_rx (16 pins), ultrasonic_tx (U7.6 U7.10 U8.2), accero_humid_rtc (C21.2 U9.2 Y1.3), mcu (26 pins), programming (14 pins), bluetooth (21 pins)
VBAT: power (BC1.1 C1.1 U1.1 U1.3), programming (C37.1 U15.5)
VCC3.3: power (5 pins), ultrasonic_rx (7 pins), ultrasonic_tx (U7.5 U8.5), accero_humid_rtc (5 pins), mcu (21 pins), bluetooth (7 pins)
VREF: power (C5.1 U2.2), ultrasonic_rx (10 pins)
BLE_ACTIVE: mcu (U12.53), bluetooth (U14.6)
BLE_RDYN: mcu (U12.48), bluetooth (U14.16)
BLE_REQN: mcu (U12.51), bluetooth (U14.12)
I2C_SCL: accero_humid_rtc (R16.2 U9.6 Y1.8), mcu (U12.12)
I2C_SDA: accero_humid_rtc (R15.2 U9.1 Y1.1), mcu (U12.11)
NetB1_1: mcu (U11.1), bluetooth (B1.1)
NetC7_1: ultrasonic_rx (C7.1), ultrasonic_tx (U7.4)
PWM: ultrasonic_tx (U8.3), mcu (U12.14)
ROM_CONTROL: mcu (U12.18), programming (U16.31)
ROM_RESET: mcu (Q2.2), programming (U16.32)
ROM_UART_RXD: mcu (U12.16), programming (U16.30)
ROM_UART_TXD: mcu (U12.17), programming (U16.2)
SPI_MISO: mcu (U12.49 U13.2), bluetooth (U14.14)
SPI_MOSI: mcu (U12.50 U13.5), bluetooth (U14.13)
SPI_SCK: mcu (U12.52 U13.6), bluetooth (U14.11)
TXRX_SELECT: ultrasonic_tx (U7.2 U7.8), mcu (U12.13)
VCC3.3-USB: mcu (Q2.1 R23.1), programming (C38.1 D2.1 U16.1 U16.16)